# Altium schematic sheet DDR3.SchDoc
size A4
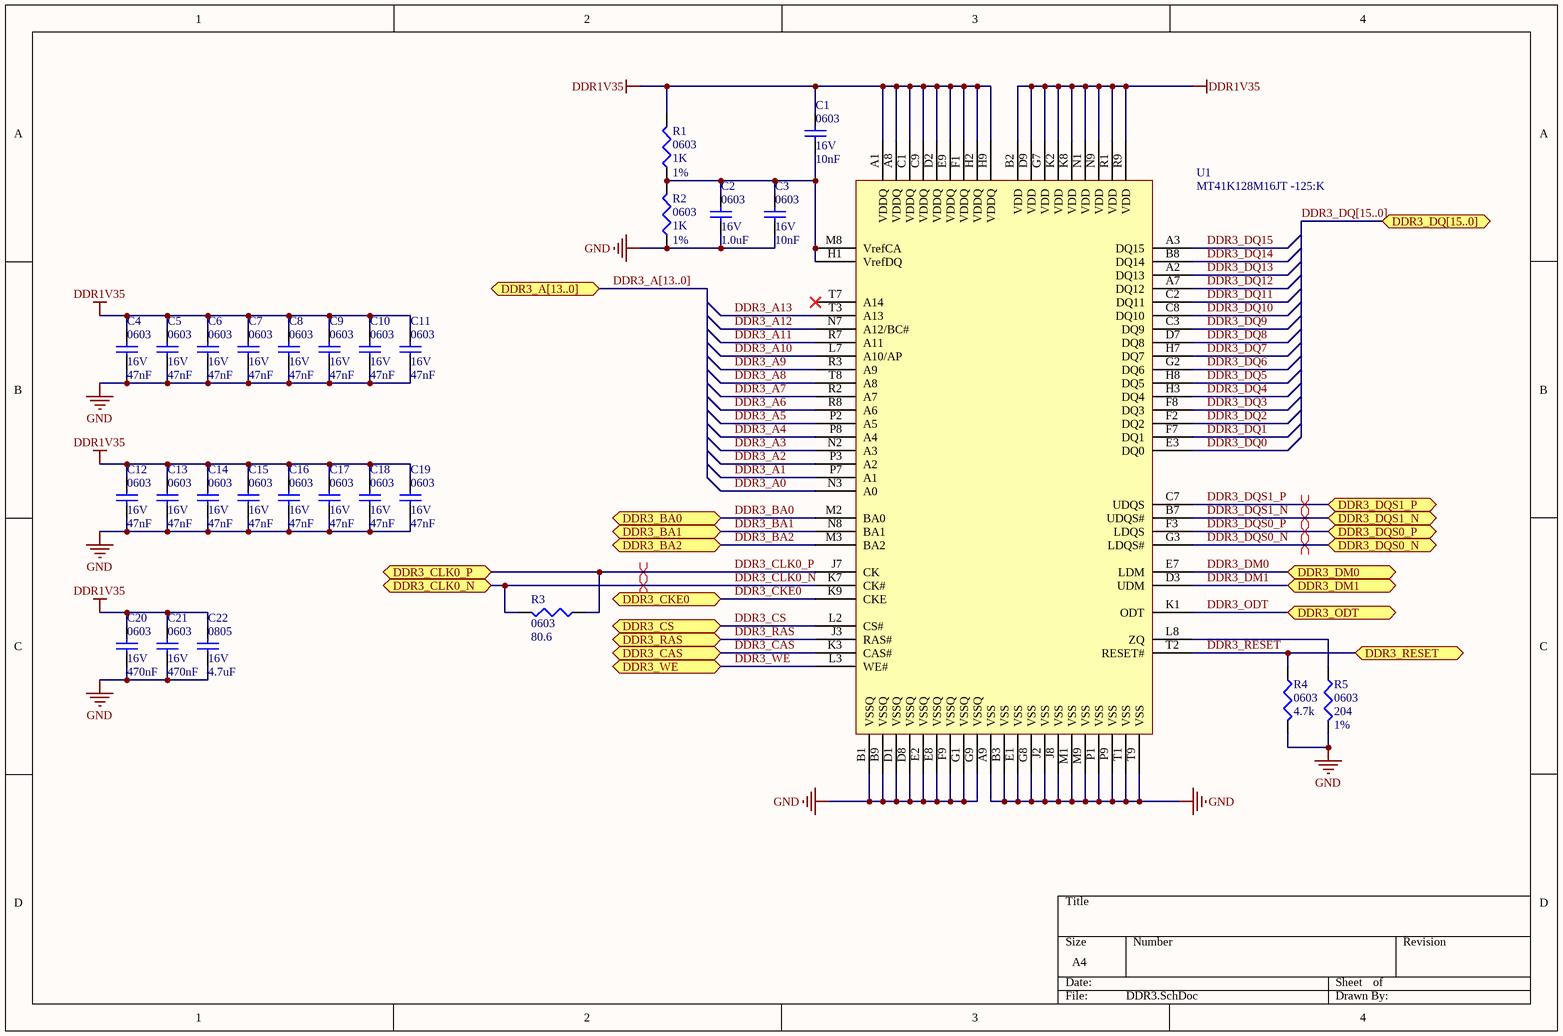
[diagram p0: DDR3.SchDoc]

## Parts
C1  PackageReference: 0603  V: 16V  [1608[0603]]  (hidden comment: 10nF)
C2  PackageReference: 0603  V: 16V  [1608[0603]]  (hidden comment: 1.0uF)
C3  PackageReference: 0603  V: 16V  [1608[0603]]  (hidden comment: 10nF)
C4  PackageReference: 0603  V: 16V  [1608[0603]]  (hidden comment: 47nF)
C5  PackageReference: 0603  V: 16V  [1608[0603]]  (hidden comment: 47nF)
C6  PackageReference: 0603  V: 16V  [1608[0603]]  (hidden comment: 47nF)
C7  PackageReference: 0603  V: 16V  [1608[0603]]  (hidden comment: 47nF)
C8  PackageReference: 0603  V: 16V  [1608[0603]]  (hidden comment: 47nF)
C9  PackageReference: 0603  V: 16V  [1608[0603]]  (hidden comment: 47nF)
C10  PackageReference: 0603  V: 16V  [1608[0603]]  (hidden comment: 47nF)
C11  PackageReference: 0603  V: 16V  [1608[0603]]  (hidden comment: 47nF)
C12  PackageReference: 0603  V: 16V  [1608[0603]]  (hidden comment: 47nF)
C13  PackageReference: 0603  V: 16V  [1608[0603]]  (hidden comment: 47nF)
C14  PackageReference: 0603  V: 16V  [1608[0603]]  (hidden comment: 47nF)
C15  PackageReference: 0603  V: 16V  [1608[0603]]  (hidden comment: 47nF)
C16  PackageReference: 0603  V: 16V  [1608[0603]]  (hidden comment: 47nF)
C17  PackageReference: 0603  V: 16V  [1608[0603]]  (hidden comment: 47nF)
C18  PackageReference: 0603  V: 16V  [1608[0603]]  (hidden comment: 47nF)
C19  PackageReference: 0603  V: 16V  [1608[0603]]  (hidden comment: 47nF)
C20  PackageReference: 0603  V: 16V  [1608[0603]]  (hidden comment: 470nF)
C21  PackageReference: 0603  V: 16V  [1608[0603]]  (hidden comment: 470nF)
C22  PackageReference: 0805  V: 16V  [2012[0805]]  (hidden comment: 4.7uF)
R1  value 1K  PackageReference: 0603  accuracy: 1%  [1608[0603]]  (hidden comment: Res3)
R2  value 1K  PackageReference: 0603  accuracy: 1%  [1608[0603]]  (hidden comment: Res3)
R3  value 80.6  PackageReference: 0603  [1608[0603]]  (hidden comment: Res3)
R4  value 4.7k  PackageReference: 0603  [1608[0603]]  (hidden comment: Res3)
R5  value 204  PackageReference: 0603  accuracy: 1%  [1608[0603]]  (hidden comment: Res3)
U1  MT41K128M16JT -125:K  [MT41K128M16JT]

## Ports
DDR3_A[13..0], DDR3_BA0, DDR3_BA1, DDR3_BA2, DDR3_CAS, DDR3_CKE0, DDR3_CLK0_N, DDR3_CLK0_P, DDR3_CS, DDR3_DM0, DDR3_DM1, DDR3_DQ[15..0], DDR3_DQS0_N, DDR3_DQS0_P, DDR3_DQS1_N, DDR3_DQS1_P, DDR3_ODT, DDR3_RAS, DDR3_RESET, DDR3_WE

## Nets
DDR1V35: C1.1 C4.1 C5.1 C6.1 C7.1 C8.1 C9.1 C10.1 C11.1 C12.1 C13.1 C14.1 C15.1 C16.1 C17.1 C18.1 C19.1 C20.1 C21.1 C22.1 R1.2 U1.A1(VDDQ) U1.A8(VDDQ) U1.B2(VDD) U1.C1(VDDQ) U1.C9(VDDQ) U1.D2(VDDQ) U1.D9(VDD) U1.E9(VDDQ) U1.F1(VDDQ) U1.G7(VDD) U1.H2(VDDQ) U1.H9(VDDQ) U1.K2(VDD) U1.K8(VDD) U1.N1(VDD) U1.N9(VDD) U1.R1(VDD) U1.R9(VDD)
GND: C2.2 C3.2 C4.2 C5.2 C6.2 C7.2 C8.2 C9.2 C10.2 C11.2 C12.2 C13.2 C14.2 C15.2 C16.2 C17.2 C18.2 C19.2 C20.2 C21.2 C22.2 R2.1 R4.2 R5.2 U1.A9(VSS) U1.B1(VSSQ) U1.B3(VSS) U1.B9(VSSQ) U1.D1(VSSQ) U1.D8(VSSQ) U1.E1(VSS) U1.E2(VSSQ) U1.E8(VSSQ) U1.F9(VSSQ) U1.G1(VSSQ) U1.G8(VSS) U1.G9(VSSQ) U1.J2(VSS) U1.J8(VSS) U1.M1(VSS) U1.M9(VSS) U1.P1(VSS) U1.P9(VSS) U1.T1(VSS) U1.T9(VSS)
DDR3_A0: U1.N3(A0)
DDR3_A1: U1.P7(A1)
DDR3_A2: U1.P3(A2)
DDR3_A3: U1.N2(A3)
DDR3_A4: U1.P8(A4)
DDR3_A5: U1.P2(A5)
DDR3_A6: U1.R8(A6)
DDR3_A7: U1.R2(A7)
DDR3_A8: U1.T8(A8)
DDR3_A9: U1.R3(A9)
DDR3_A10: U1.L7(A10/AP)
DDR3_A11: U1.R7(A11)
DDR3_A12: U1.N7(A12/BC#)
DDR3_A13: U1.T3(A13)
DDR3_BA0: U1.M2(BA0) ; port DDR3_BA0
DDR3_BA1: U1.N8(BA1) ; port DDR3_BA1
DDR3_BA2: U1.M3(BA2) ; port DDR3_BA2
DDR3_CAS: U1.K3(CAS#) ; port DDR3_CAS
DDR3_CKE0: U1.K9(CKE) ; port DDR3_CKE0
DDR3_CLK0_N: R3.2 U1.K7(CK#) ; port DDR3_CLK0_N
DDR3_CLK0_P: R3.1 U1.J7(CK) ; port DDR3_CLK0_P
DDR3_CS: U1.L2(CS#) ; port DDR3_CS
DDR3_DM0: U1.E7(LDM) ; port DDR3_DM0
DDR3_DM1: U1.D3(UDM) ; port DDR3_DM1
DDR3_DQ0: U1.E3(DQ0)
DDR3_DQ1: U1.F7(DQ1)
DDR3_DQ2: U1.F2(DQ2)
DDR3_DQ3: U1.F8(DQ3)
DDR3_DQ4: U1.H3(DQ4)
DDR3_DQ5: U1.H8(DQ5)
DDR3_DQ6: U1.G2(DQ6)
DDR3_DQ7: U1.H7(DQ7)
DDR3_DQ8: U1.D7(DQ8)
DDR3_DQ9: U1.C3(DQ9)
DDR3_DQ10: U1.C8(DQ10)
DDR3_DQ11: U1.C2(DQ11)
DDR3_DQ12: U1.A7(DQ12)
DDR3_DQ13: U1.A2(DQ13)
DDR3_DQ14: U1.B8(DQ14)
DDR3_DQ15: U1.A3(DQ15)
DDR3_DQS0_N: U1.G3(LDQS#) ; port DDR3_DQS0_N
DDR3_DQS0_P: U1.F3(LDQS) ; port DDR3_DQS0_P
DDR3_DQS1_N: U1.B7(UDQS#) ; port DDR3_DQS1_N
DDR3_DQS1_P: U1.C7(UDQS) ; port DDR3_DQS1_P
DDR3_ODT: U1.K1(ODT) ; port DDR3_ODT
DDR3_RAS: U1.J3(RAS#) ; port DDR3_RAS
DDR3_RESET: R4.1 U1.T2(RESET#) ; port DDR3_RESET
DDR3_WE: U1.L3(WE#) ; port DDR3_WE
NetC1_2: C1.2 C2.1 C3.1 R1.1 R2.2 U1.H1(VrefDQ) U1.M8(VrefCA)
NetR5_1: R5.1 U1.L8(ZQ)

Not connected (* = marked no-connect by the designer): U1 T7(A14)*

## Buses and harness runs
bus DDR3_A[13..0] = port DDR3_A[13..0]
bus DDR3_DQ[15..0] = port DDR3_DQ[15..0]

## Layout directives
differential pair: DDR3_CLK0_N, DDR3_CLK0_P, DDR3_DQS0_N, DDR3_DQS0_P, DDR3_DQS1_N, DDR3_DQS1_P

## Library data of the parts
C1-C22 = Cap Semi: Capacitor (Semiconductor SIM Model); LatestRevisionDate: 17-Jul-2002; LatestRevisionNote: Re-released for DXP Platform.; Publisher: Altium Limited
  C1 C3: Value: 10nF
  C2: Value: 1.0uF
  C4-C19: Value: 47nF
  C20 C21: Value: 470nF
  C22: Value: 4.7uF
R1 R2 R5 = Res3: Resistor; Published: 8-Jun-2000; LatestRevisionDate: 29-May-2009; LatestRevisionNote: IPC-7351 Footprint Added.; Publisher: Altium Limited; PackageDescription: Chip Resistor
R3 R4 = Res3: Resistor; accuracy: 1%; Published: 8-Jun-2000; LatestRevisionDate: 29-May-2009; LatestRevisionNote: IPC-7351 Footprint Added.; Publisher: Altium Limited; PackageDescription: Chip Resistor
U1 = MT41K128M16JT -125:K: DDR3L